# EAGLE schematic car (EAGLE 6.5.0)
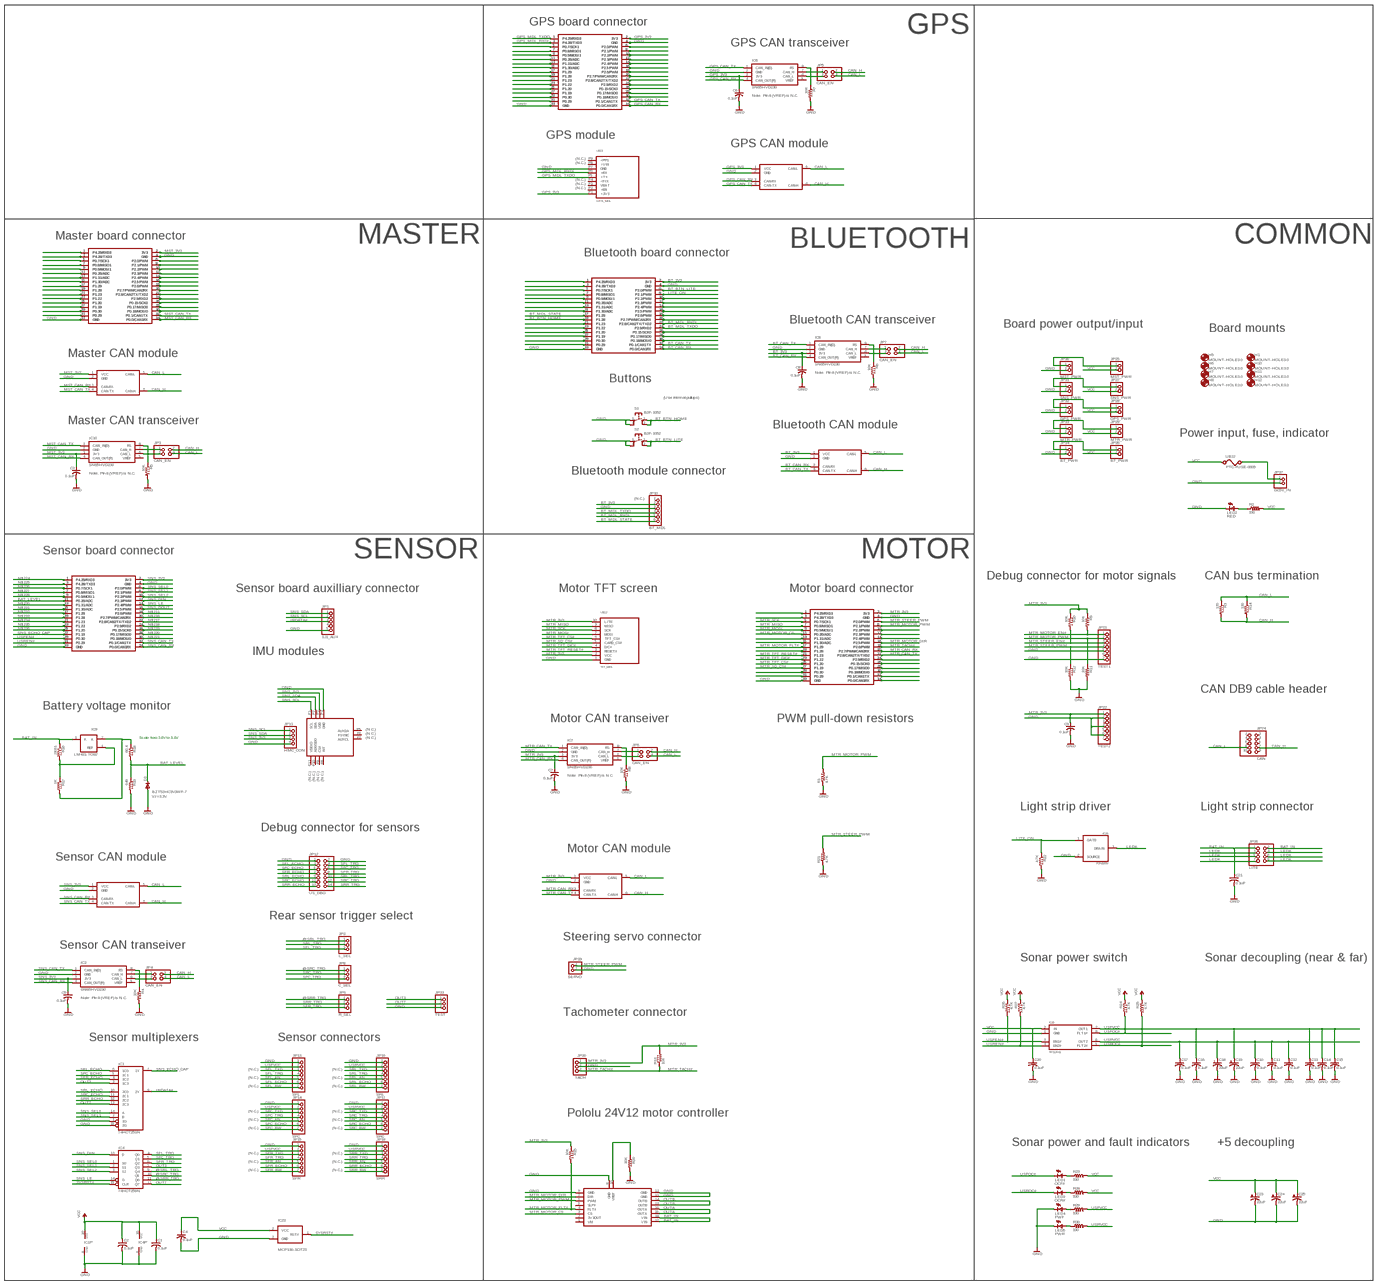
[diagram p0: schematic, sheet 1, overview]
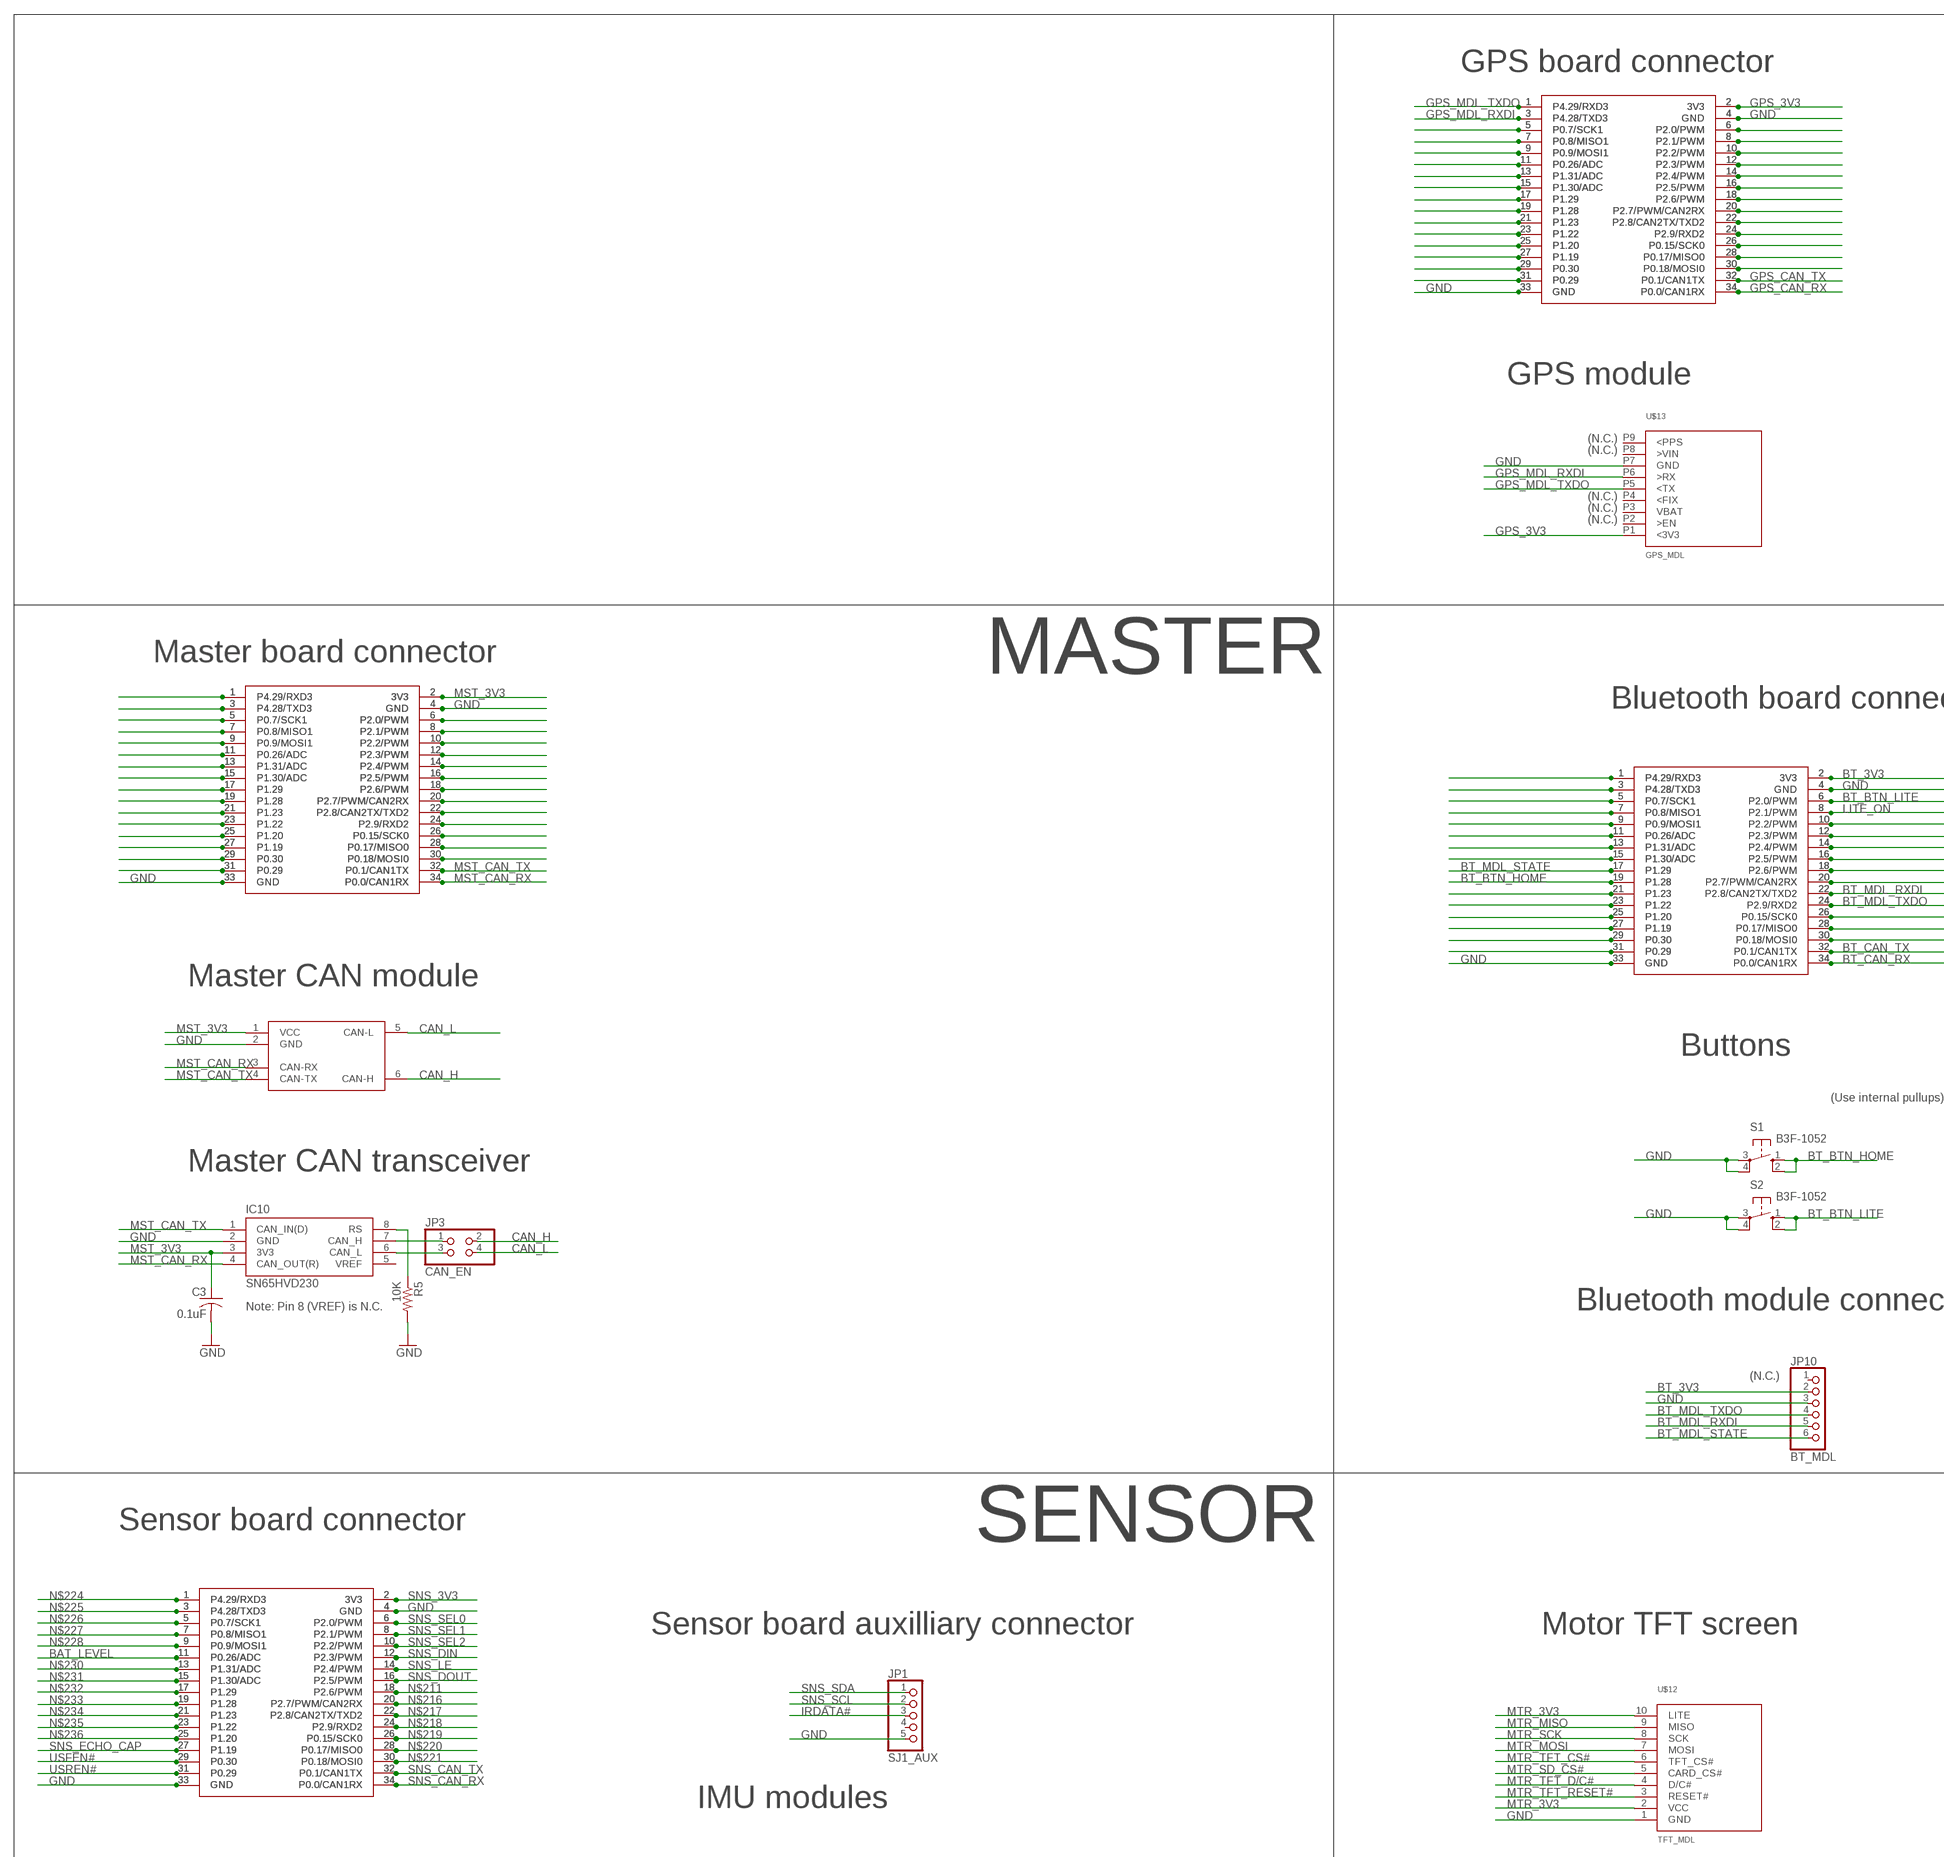
[diagram p1: schematic, sheet 1, part 1 of 4]
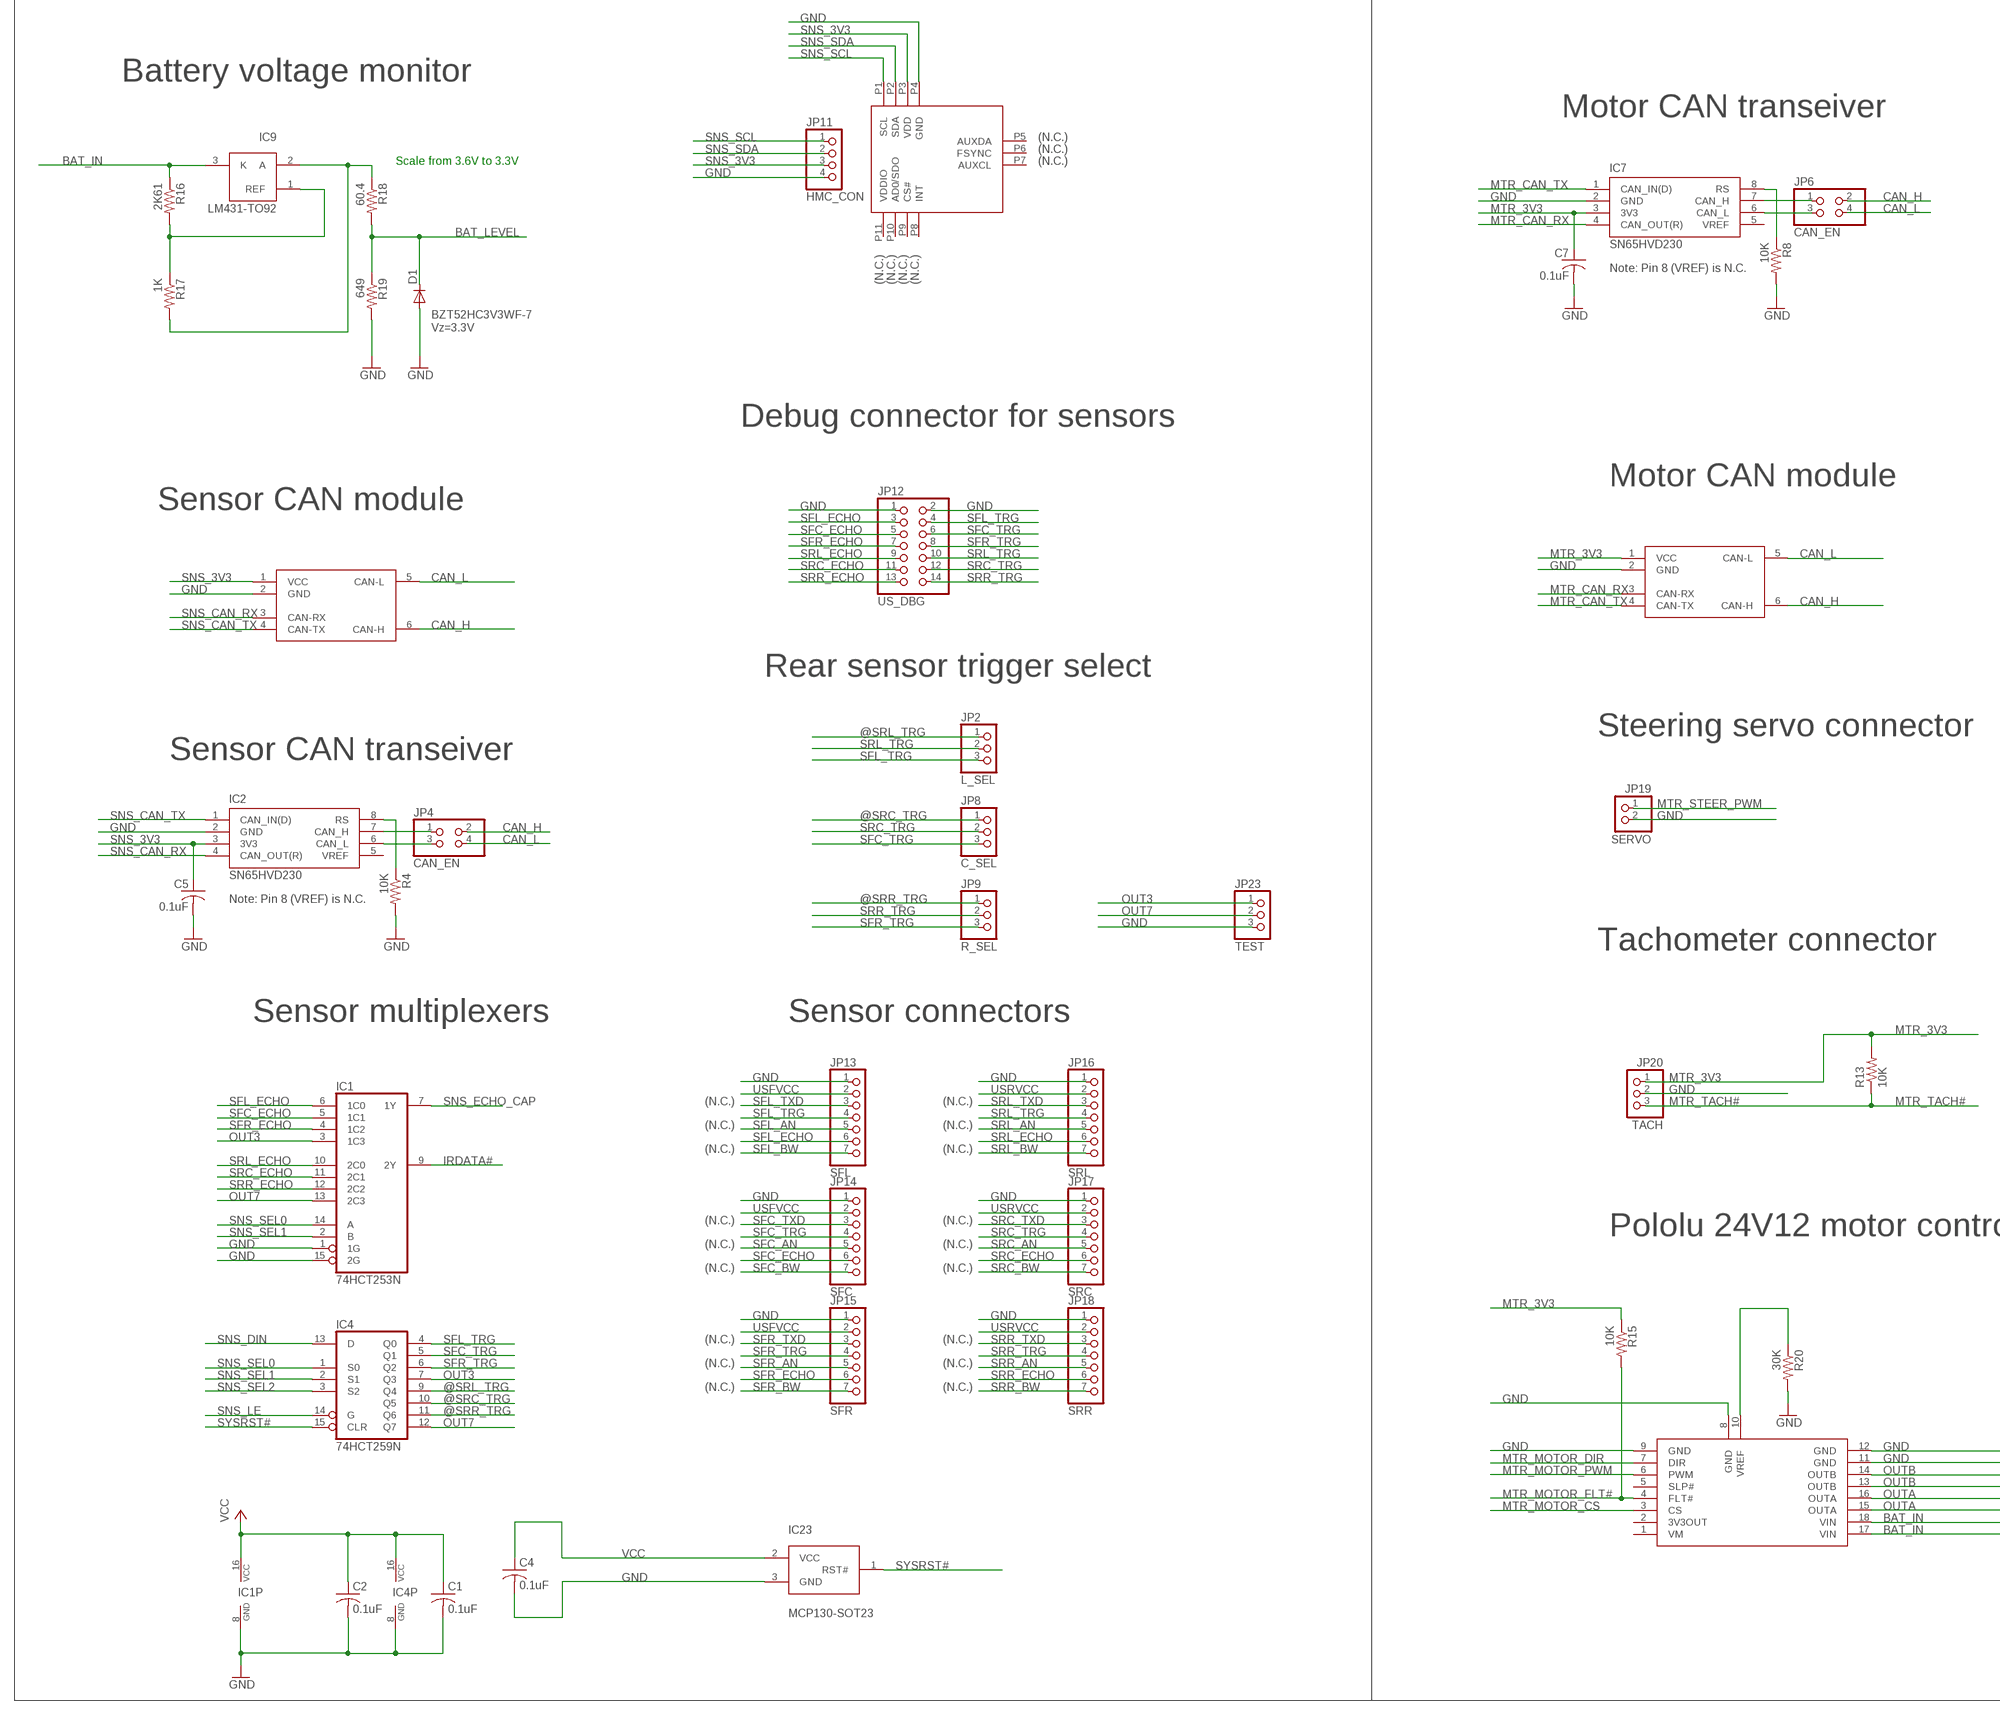
[diagram p2: schematic, sheet 1, part 2 of 4]
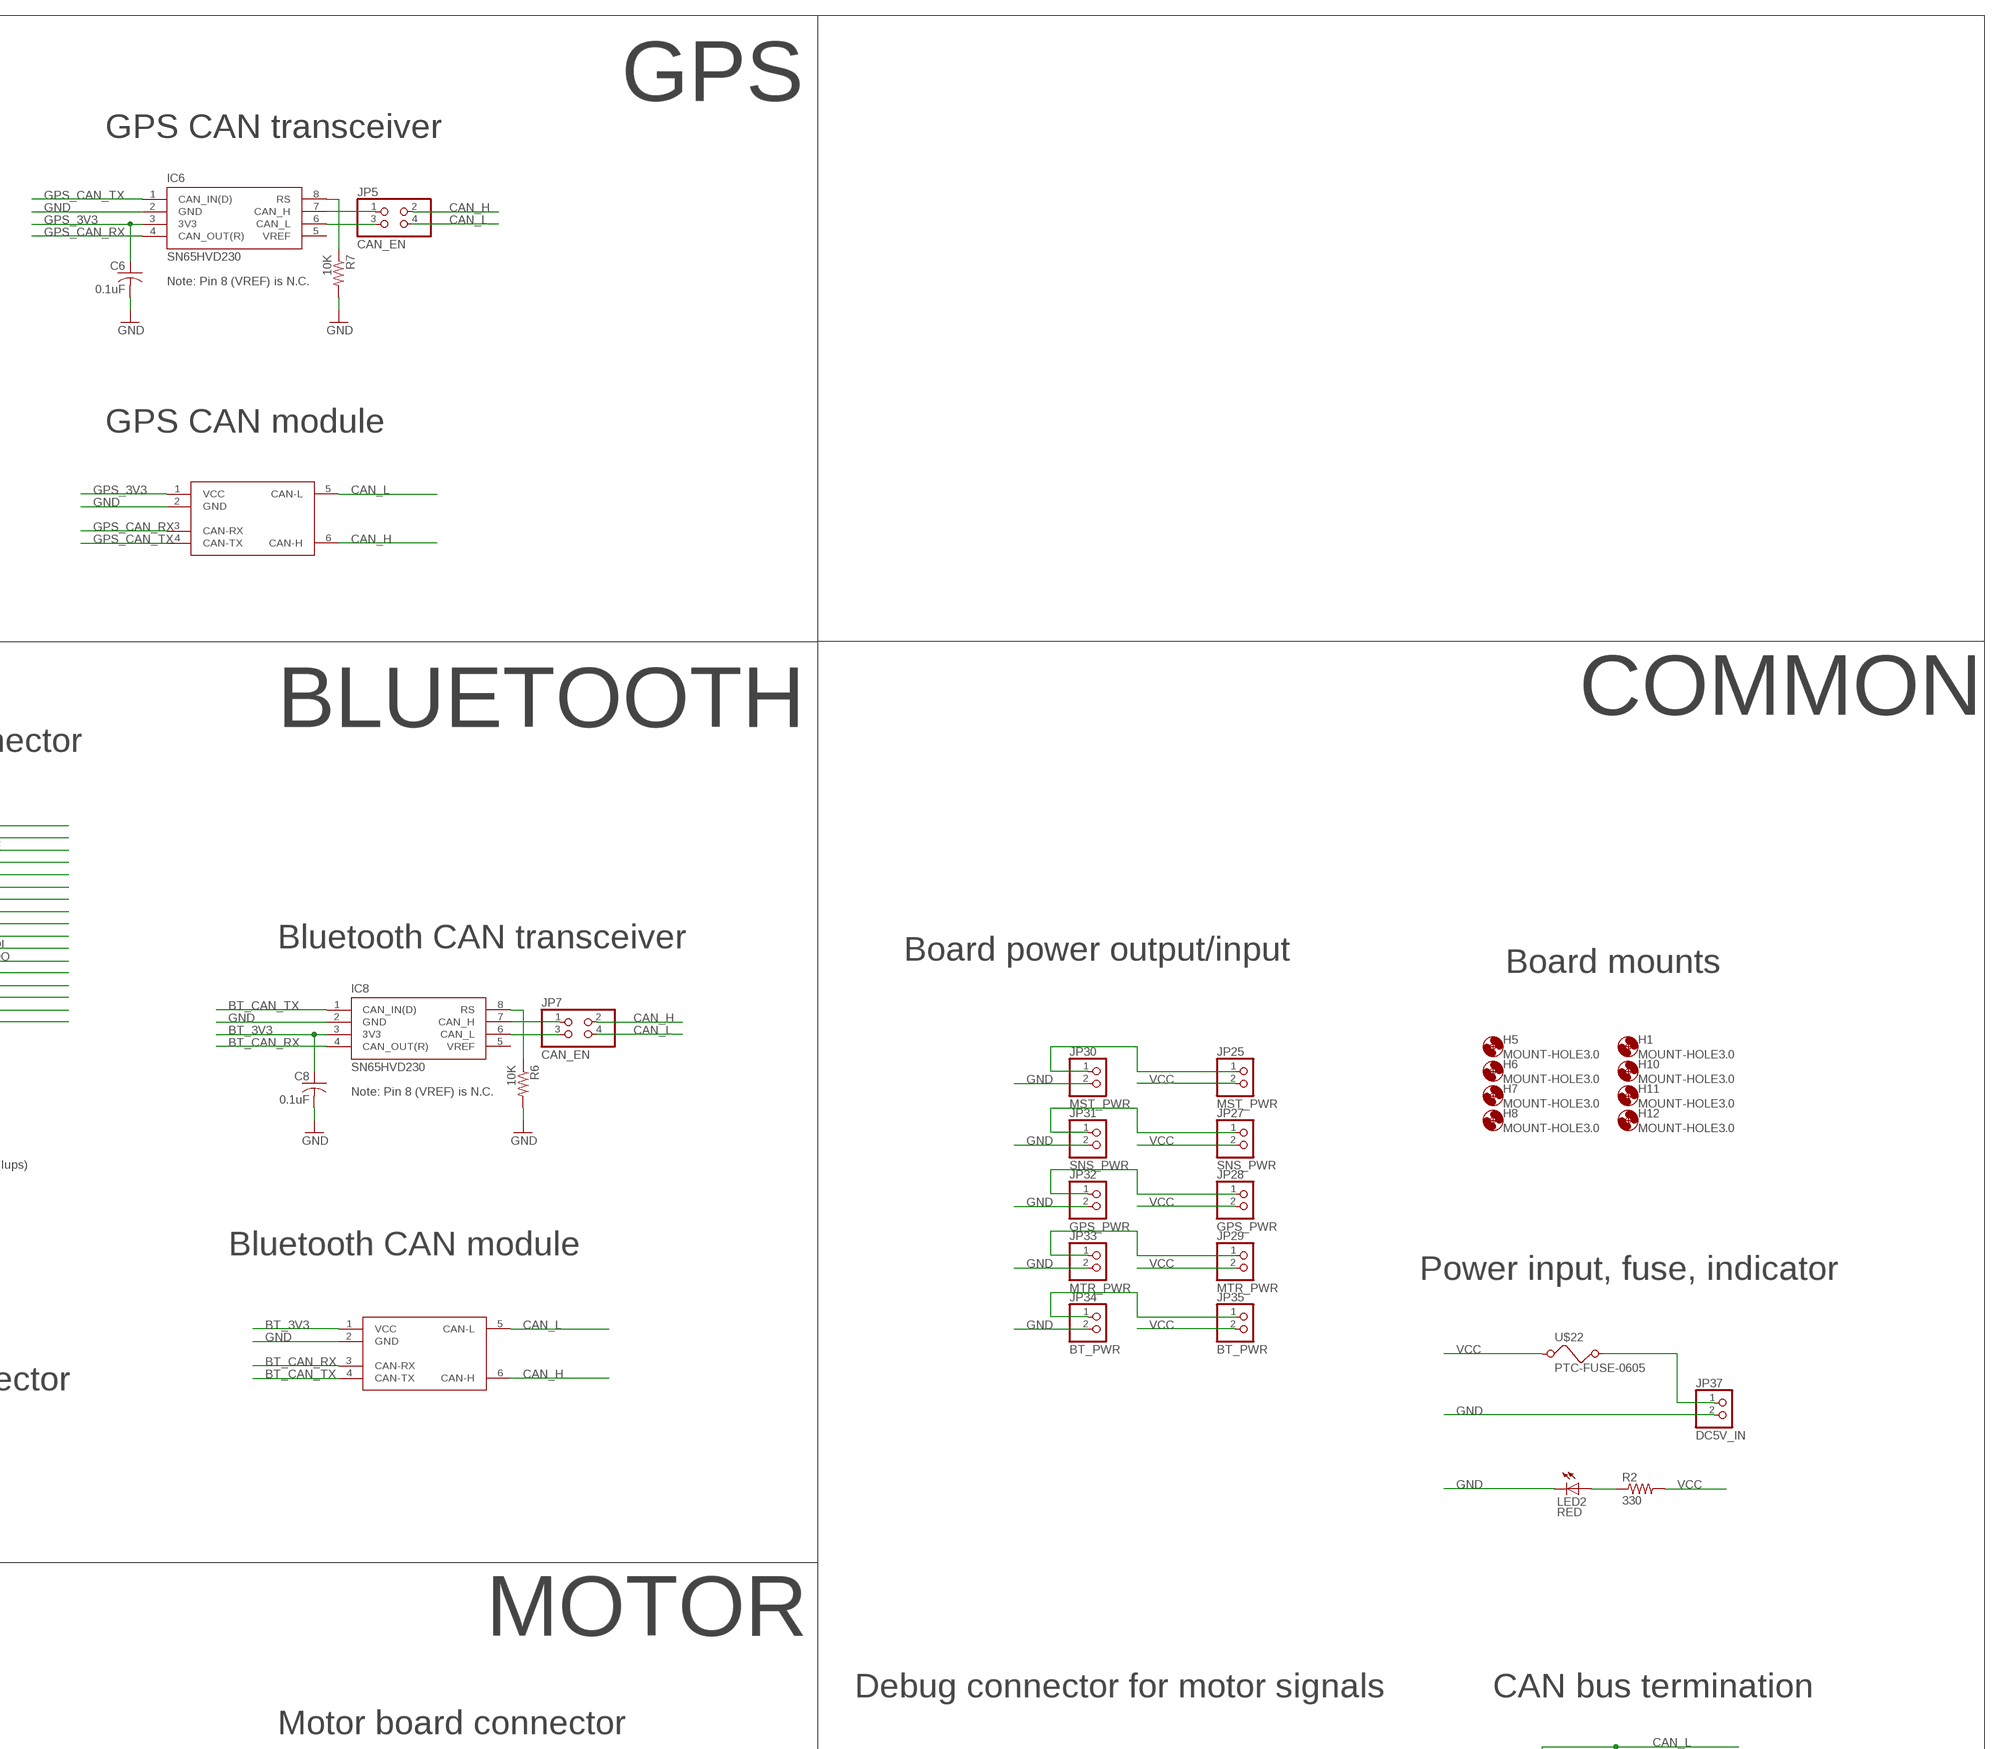
[diagram p3: schematic, sheet 1, part 3 of 4]
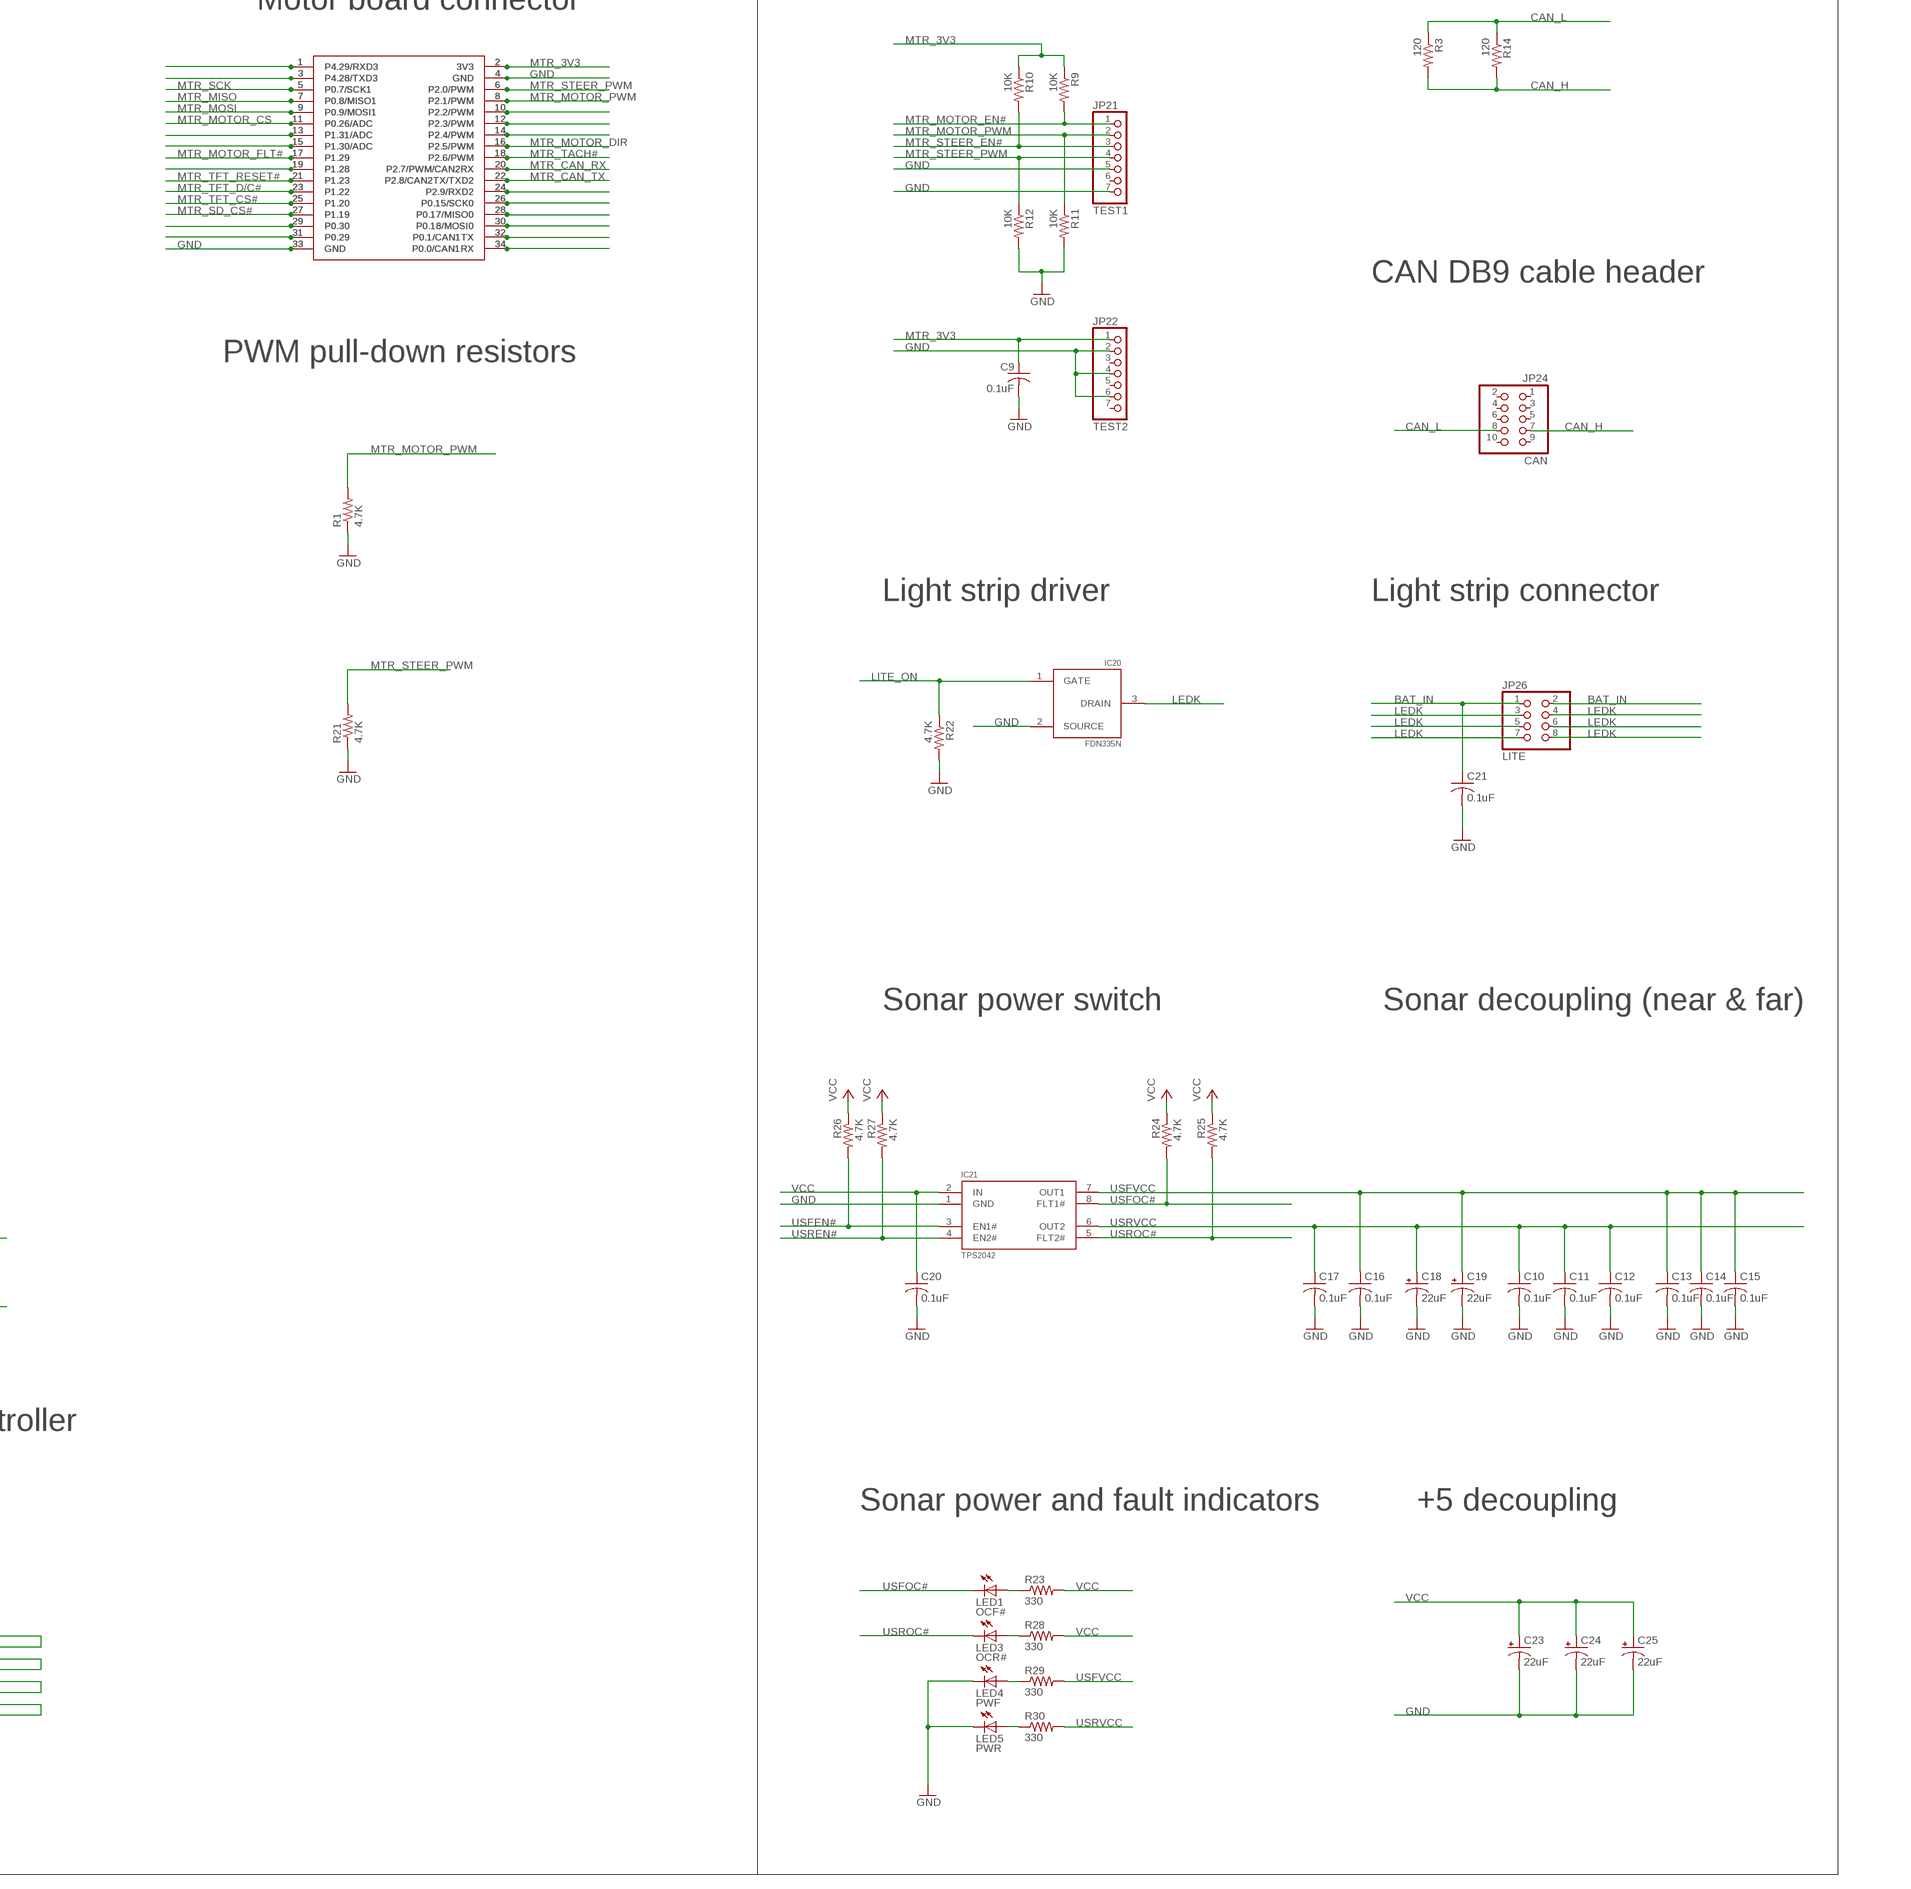
[diagram p4: schematic, sheet 1, part 4 of 4]

## Parts
C1  0.1uF  C-USC0603K  [C0603K]
C2  0.1uF  C-USC0603K  [C0603K]
C3  0.1uF  C-USC0603K  [C0603K]
C4  0.1uF  C-USC0603K  [C0603K]
C5  0.1uF  C-USC0603K  [C0603K]
C6  0.1uF  C-USC0603K  [C0603K]
C7  0.1uF  C-USC0603K  [C0603K]
C8  0.1uF  C-USC0603K  [C0603K]
C9  0.1uF  C-USC0603K  [C0603K]
C10  0.1uF  C-USC0603K  [C0603K]
C11  0.1uF  C-USC0603K  [C0603K]
C12  0.1uF  C-USC0603K  [C0603K]
C13  0.1uF  C-USC0603K  [C0603K]
C14  0.1uF  C-USC0603K  [C0603K]
C15  0.1uF  C-USC0603K  [C0603K]
C16  0.1uF  C-USC0603K  [C0603K]
C17  0.1uF  C-USC0603K  [C0603K]
C18  22uF  CPOL-USD/7343-31W  [D/7343-31W]
C19  22uF  CPOL-USD/7343-31W  [D/7343-31W]
C20  0.1uF  C-USC0603K  [C0603K]
C21  0.1uF  C-USC0603K  [C0603K]
C23  22uF  CPOL-USD/7343-31W  [D/7343-31W]
C24  22uF  CPOL-USD/7343-31W  [D/7343-31W]
C25  22uF  CPOL-USD/7343-31W  [D/7343-31W]
D1  BZT52HC3V3WF-7  DIODE-SOD323-W  [SOD323-W]
H1  MOUNT-HOLE3.0  [3,0]
H5  MOUNT-HOLE3.0  [3,0]
H6  MOUNT-HOLE3.0  [3,0]
H7  MOUNT-HOLE3.0  [3,0]
H8  MOUNT-HOLE3.0  [3,0]
H10  MOUNT-HOLE3.0  [3,0]
H11  MOUNT-HOLE3.0  [3,0]
H12  MOUNT-HOLE3.0  [3,0]
IC1  74HCT253N  [DIL16]
IC2  SN65HVD230  [SOIC8]
IC4  74HCT259N  [DIL16]
IC6  SN65HVD230  [SOIC8]
IC7  SN65HVD230  [SOIC8]
IC8  SN65HVD230  [SOIC8]
IC9  LM431-TO92  [TO-92]
IC10  SN65HVD230  [SOIC8]
IC20  FDN335N  [SOT23-3]
IC21  TPS2042  [SOIC8]
IC22  24V21  [24V21]
IC23  MCP130-SOT23  [SOT23-3]
IMU_MDL  MPU9250  [MPU9250]
JP1  SJ1_AUX  PINHD-1X5  [1X05]
JP2  L_SEL  PINHD-1X3  [1X03]
JP3  CAN_EN  PINHD-2X2  [2X02]
JP4  CAN_EN  PINHD-2X2  [2X02]
JP5  CAN_EN  PINHD-2X2  [2X02]
JP6  CAN_EN  PINHD-2X2  [2X02]
JP7  CAN_EN  PINHD-2X2  [2X02]
JP8  C_SEL  PINHD-1X3  [1X03]
JP9  R_SEL  PINHD-1X3  [1X03]
JP10  BT_MDL  PINHD-1X6  [1X06]
JP11  HMC_CON  PINHD-1X4  [1X04]
JP12  US_DBG  PINHD-2X7  [2X07]
JP13  SFL  PINHD-1X7  [1X07]
JP14  SFC  PINHD-1X7  [1X07]
JP15  SFR  PINHD-1X7  [1X07]
JP16  SRL  PINHD-1X7  [1X07]
JP17  SRC  PINHD-1X7  [1X07]
JP18  SRR  PINHD-1X7  [1X07]
JP19  SERVO  PINHD-1X2  [1X02]
JP20  TACH  PINHD-1X3  [1X03]
JP21  TEST1  PINHD-1X7  [1X07]
JP22  TEST2  PINHD-1X7  [1X07]
JP23  TEST  PINHD-1X3  [1X03]
JP24  CAN  PINHD-2X5  [2X05]
JP25  MST_PWR  PINHD-1X2  [1X02]
JP26  LITE  PINHD-2X4  [2X04]
JP27  SNS_PWR  PINHD-1X2  [1X02]
JP28  GPS_PWR  PINHD-1X2  [1X02]
JP29  MTR_PWR  PINHD-1X2  [1X02]
JP30  MST_PWR  PINHD-1X2  [1X02]
JP31  SNS_PWR  PINHD-1X2  [1X02]
JP32  GPS_PWR  PINHD-1X2  [1X02]
JP33  MTR_PWR  PINHD-1X2  [1X02]
JP34  BT_PWR  PINHD-1X2  [1X02]
JP35  BT_PWR  PINHD-1X2  [1X02]
JP37  DC5V_IN  PINHD-1X2  [1X02]
LED1  OCF#  LEDCHIPLED_0603  [CHIPLED_0603]
LED2  RED  LEDCHIPLED_0603  [CHIPLED_0603]
LED3  OCR#  LEDCHIPLED_0603  [CHIPLED_0603]
LED4  PWF  LEDCHIPLED_0603  [CHIPLED_0603]
LED5  PWR  LEDCHIPLED_0603  [CHIPLED_0603]
R1  4.7K  R-US_R0603  [R0603]
R2  330  R-US_R0603  [R0603]
R3  120  R-US_R0603  [R0603]
R4  10K  R-US_R0603  [R0603]
R5  10K  R-US_R0603  [R0603]
R6  10K  R-US_R0603  [R0603]
R7  10K  R-US_R0603  [R0603]
R8  10K  R-US_R0603  [R0603]
R9  10K  R-US_R0603  [R0603]
R10  10K  R-US_R0603  [R0603]
R11  10K  R-US_R0603  [R0603]
R12  10K  R-US_R0603  [R0603]
R13  10K  R-US_R0603  [R0603]
R14  120  R-US_R0603  [R0603]
R15  10K  R-US_R0603  [R0603]
R16  2K61  R-US_R0603  [R0603]
R17  1K  R-US_R0603  [R0603]
R18  60.4  R-US_R0603  [R0603]
R19  649  R-US_R0603  [R0603]
R20  30K  R-US_R0603  [R0603]
R21  4.7K  R-US_R0603  [R0603]
R22  4.7K  R-US_R0603  [R0603]
R23  330  R-US_R0603  [R0603]
R24  4.7K  R-US_R0603  [R0603]
R25  4.7K  R-US_R0603  [R0603]
R26  4.7K  R-US_R0603  [R0603]
R27  4.7K  R-US_R0603  [R0603]
R28  330  R-US_R0603  [R0603]
R29  330  R-US_R0603  [R0603]
R30  330  R-US_R0603  [R0603]
S1  B3F-1052  10-XX  [B3F-10XX]
S2  B3F-1052  10-XX  [B3F-10XX]
U$7  WAVESHARE-CAN  [WAVESHARE-CAN]
U$8  WAVESHARE-CAN  [WAVESHARE-CAN]
U$9  WAVESHARE-CAN  [WAVESHARE-CAN]
U$10  WAVESHARE-CAN  [WAVESHARE-CAN]
U$11  WAVESHARE-CAN  [WAVESHARE-CAN]
U$12  TFT_MDL  ADA-TFT  [ADA-TFT]
U$13  GPS_MDL  ADA-GPS  [ADA-GPS]
U$19  SJ1_CONN  [SJ1_CONN]
U$20  SJ1_CONN  [SJ1_CONN]
U$22  PTC-FUSE-0605  [R0605]
U$23  SJ1_CONN  [SJ1_CONN]
U$24  SJ1_CONN  [SJ1_CONN]
U$25  SJ1_CONN  [SJ1_CONN]
U$26  SJ1_CONN  [SJ1_CONN]
U$27  SJ1_CONN  [SJ1_CONN]
U$28  SJ1_CONN  [SJ1_CONN]
U$29  SJ1_CONN  [SJ1_CONN]
U$30  SJ1_CONN  [SJ1_CONN]

## Nets
@CAN_H: IC10.7(CAN_H) JP3.1
@CAN_H1: IC2.7(CAN_H) JP4.1
@CAN_H2: IC6.7(CAN_H) JP5.1
@CAN_H3: IC7.7(CAN_H) JP6.1
@CAN_H4: IC8.7(CAN_H) JP7.1
@CAN_L: IC10.6(CAN_L) JP3.3
@CAN_L1: IC2.6(CAN_L) JP4.3
@CAN_L2: IC6.6(CAN_L) JP5.3
@CAN_L3: IC7.6(CAN_L) JP6.3
@CAN_L4: IC8.6(CAN_L) JP7.3
@SRC_TRG: IC4.10(Q5) JP8.1
@SRL_TRG: IC4.9(Q4) JP2.1
@SRR_TRG: IC4.11(Q6) JP9.1
BAT_IN: C21.1 IC9.3(K) IC22.17(VIN) IC22.18(VIN) JP26.1 JP26.2 R16.1
BAT_LEVEL: D1.C R18.2 R19.1 U$19.11(P0.26/ADC) U$20.11(P0.26/ADC)
BT_3V3: C8.1 IC8.3(3V3) JP10.2 U$8.1(VCC) U$27.2(3V3) U$30.2(3V3)
BT_BTN_HOME: S1.1(S) S1.2(S1) U$27.19(P1.28) U$30.19(P1.28)
BT_BTN_LITE: S2.1(S) S2.2(S1) U$27.6(P2.0/PWM) U$30.6(P2.0/PWM)
BT_CAN_RX: IC8.4(CAN_OUT(R)) U$8.3(CAN-RX) U$27.34(P0.0/CAN1RX) U$30.34(P0.0/CAN1RX)
BT_CAN_TX: IC8.1(CAN_IN(D)) U$8.4(CAN-TX) U$27.32(P0.1/CAN1TX) U$30.32(P0.1/CAN1TX)
BT_MDL_RXDI: JP10.5 U$27.22(P2.8/CAN2TX/TXD2) U$30.22(P2.8/CAN2TX/TXD2)
BT_MDL_STATE: JP10.6 U$27.17(P1.29) U$30.17(P1.29)
BT_MDL_TXDO: JP10.4 U$27.24(P2.9/RXD2) U$30.24(P2.9/RXD2)
CAN_H: JP3.2 JP4.2 JP5.2 JP6.2 JP7.2 JP24.7 R3.2 R14.2 U$7.6(CAN-H) U$8.6(CAN-H) U$9.6(CAN-H) U$10.6(CAN-H) U$11.6(CAN-H)
CAN_L: JP3.4 JP4.4 JP5.4 JP6.4 JP7.4 JP24.8 R3.1 R14.1 U$7.5(CAN-L) U$8.5(CAN-L) U$9.5(CAN-L) U$10.5(CAN-L) U$11.5(CAN-L)
EXT_VCC: JP37.1 U$22.2
GND: C1.2 C2.2 C3.2 C4.2 C5.2 C6.2 C7.2 C8.2 C9.2 C10.2 C11.2 C12.2 C13.2 C14.2 C15.2 C16.2 C17.2 C18.- C19.- C20.2 C21.2 C23.- C24.- C25.- D1.A IC1.1(1G) IC1.8(GND) IC1.15(2G) IC2.2(GND) IC4.8(GND) IC6.2(GND) IC7.2(GND) IC8.2(GND) IC10.2(GND) IC20.2(SOURCE) IC21.1(GND) IC22.8(GND) IC22.9(GND) IC22.11(GND) IC22.12(GND) IC23.3(GND) IMU_MDL.P4(GND) JP1.5 JP10.3 JP11.4 JP12.1 JP12.2 JP13.1 JP14.1 JP15.1 JP16.1 JP17.1 JP18.1 JP19.2 JP20.2 JP21.5 JP21.7 JP22.2 JP22.4 JP22.6 JP23.3 JP30.2 JP31.2 JP32.2 JP33.2 JP34.2 JP37.2 LED2.C LED4.C LED5.C R1.1 R4.2 R5.2 R6.2 R7.2 R8.2 R11.2 R12.2 R19.2 R20.2 R21.1 R22.2 S1.3(P) S1.4(P1) S2.3(P) S2.4(P1) U$7.2(GND) U$8.2(GND) U$9.2(GND) U$10.2(GND) U$11.2(GND) U$12.1(GND) U$13.P7(GND) U$19.4(GND) U$19.33(GND) U$20.4(GND) U$20.33(GND) U$23.4(GND) U$23.33(GND) U$24.4(GND) U$24.33(GND) U$25.4(GND) U$25.33(GND) U$26.4(GND) U$26.33(GND) U$27.4(GND) U$27.33(GND) U$28.4(GND) U$28.33(GND) U$29.4(GND) U$29.33(GND) U$30.4(GND) U$30.33(GND)
GPS_3V3: C6.1 IC6.3(3V3) U$10.1(VCC) U$13.P1(<3V3) U$28.2(3V3) U$29.2(3V3)
GPS_CAN_RX: IC6.4(CAN_OUT(R)) U$10.3(CAN-RX) U$28.34(P0.0/CAN1RX) U$29.34(P0.0/CAN1RX)
GPS_CAN_TX: IC6.1(CAN_IN(D)) U$10.4(CAN-TX) U$28.32(P0.1/CAN1TX) U$29.32(P0.1/CAN1TX)
GPS_MDL_RXDI: U$13.P6(>RX) U$28.3(P4.28/TXD3) U$29.3(P4.28/TXD3)
GPS_MDL_TXDO: U$13.P5(<TX) U$28.1(P4.29/RXD3) U$29.1(P4.29/RXD3)
IRDATA#: IC1.9(2Y) JP1.3
LEDK: IC20.3(DRAIN) JP26.3 JP26.4 JP26.5 JP26.6 JP26.7 JP26.8
LITE_ON: IC20.1(GATE) R22.1 U$27.8(P2.1/PWM) U$30.8(P2.1/PWM)
MST_3V3: C3.1 IC10.3(3V3) U$7.1(VCC) U$23.2(3V3) U$24.2(3V3)
MST_CAN_RX: IC10.4(CAN_OUT(R)) U$7.3(CAN-RX) U$23.34(P0.0/CAN1RX) U$24.34(P0.0/CAN1RX)
MST_CAN_TX: IC10.1(CAN_IN(D)) U$7.4(CAN-TX) U$23.32(P0.1/CAN1TX) U$24.32(P0.1/CAN1TX)
MTR_3V3: C7.1 C9.1 IC7.3(3V3) JP20.1 JP22.1 R9.1 R10.1 R13.2 R15.1 U$11.1(VCC) U$12.2(VCC) U$12.10(LITE) U$25.2(3V3) U$26.2(3V3)
MTR_CAN_RX: IC7.4(CAN_OUT(R)) U$11.3(CAN-RX) U$25.20(P2.7/PWM/CAN2RX) U$26.20(P2.7/PWM/CAN2RX)
MTR_CAN_TX: IC7.1(CAN_IN(D)) U$11.4(CAN-TX) U$25.22(P2.8/CAN2TX/TXD2) U$26.22(P2.8/CAN2TX/TXD2)
MTR_MISO: U$12.9(MISO) U$25.7(P0.8/MISO1) U$26.7(P0.8/MISO1)
MTR_MOSI: U$12.7(MOSI) U$25.9(P0.9/MOSI1) U$26.9(P0.9/MOSI1)
MTR_MOTOR_CS: IC22.3(CS) U$25.11(P0.26/ADC) U$26.11(P0.26/ADC)
MTR_MOTOR_DIR: IC22.7(DIR) U$25.16(P2.5/PWM) U$26.16(P2.5/PWM)
MTR_MOTOR_EN#: JP21.1 R9.2 U$25.14(P2.4/PWM) U$26.14(P2.4/PWM)
MTR_MOTOR_FLT#: IC22.4(FLT#) R15.2 U$25.17(P1.29) U$26.17(P1.29)
MTR_MOTOR_PWM: IC22.6(PWM) JP21.2 R1.2 R11.1 U$25.8(P2.1/PWM) U$26.8(P2.1/PWM)
MTR_SCK: U$12.8(SCK) U$25.5(P0.7/SCK1) U$26.5(P0.7/SCK1)
MTR_SD_CS#: U$12.5(CARD_CS#) U$25.27(P1.19) U$26.27(P1.19)
MTR_STEER_EN#: JP21.3 R10.2 U$25.12(P2.3/PWM) U$26.12(P2.3/PWM)
MTR_STEER_PWM: JP19.1 JP21.4 R12.1 R21.2 U$25.6(P2.0/PWM) U$26.6(P2.0/PWM)
MTR_TACH#: JP20.3 R13.1 U$25.18(P2.6/PWM) U$26.18(P2.6/PWM)
MTR_TFT_CS#: U$12.6(TFT_CS#) U$25.25(P1.20) U$26.25(P1.20)
MTR_TFT_D/C#: U$12.4(D/C#) U$25.23(P1.22) U$26.23(P1.22)
MTR_TFT_RESET#: U$12.3(RESET#) U$25.21(P1.23) U$26.21(P1.23)
N$1: IC10.8(RS) R5.1
N$2: IC2.8(RS) R4.1
N$3: IC6.8(RS) R7.1
N$4: IC7.8(RS) R8.1
N$5: IC8.8(RS) R6.1
N$6: LED2.A R2.1
N$7: IC22.10(VREF) R20.1
N$8: LED1.A R23.1
N$9: LED3.A R28.1
N$10: LED4.A R29.1
N$11: LED5.A R30.1
N$12: IC9.2(A) R17.2 R18.1
N$13: JP34.1 JP35.1
N$14: U$25.1(P4.29/RXD3) U$26.1(P4.29/RXD3)
N$15: U$25.3(P4.28/TXD3) U$26.3(P4.28/TXD3)
N$16: JP29.1 JP33.1
N$17: JP28.1 JP32.1
N$18: JP27.1 JP31.1
N$19: JP25.1 JP30.1
N$23: U$25.13(P1.31/ADC) U$26.13(P1.31/ADC)
N$24: U$25.15(P1.30/ADC) U$26.15(P1.30/ADC)
N$26: U$25.19(P1.28) U$26.19(P1.28)
N$54: U$25.29(P0.30) U$26.29(P0.30)
N$55: U$25.31(P0.29) U$26.31(P0.29)
N$56: U$27.1(P4.29/RXD3) U$30.1(P4.29/RXD3)
N$57: U$27.3(P4.28/TXD3) U$30.3(P4.28/TXD3)
N$58: U$27.5(P0.7/SCK1) U$30.5(P0.7/SCK1)
N$74: U$25.10(P2.2/PWM) U$26.10(P2.2/PWM)
N$81: U$25.24(P2.9/RXD2) U$26.24(P2.9/RXD2)
N$82: U$25.26(P0.15/SCK0) U$26.26(P0.15/SCK0)
N$83: U$25.28(P0.17/MISO0) U$26.28(P0.17/MISO0)
N$84: U$25.30(P0.18/MOSI0) U$26.30(P0.18/MOSI0)
N$85: U$25.32(P0.1/CAN1TX) U$26.32(P0.1/CAN1TX)
N$86: U$25.34(P0.0/CAN1RX) U$26.34(P0.0/CAN1RX)
N$87: U$27.7(P0.8/MISO1) U$30.7(P0.8/MISO1)
N$88: U$27.9(P0.9/MOSI1) U$30.9(P0.9/MOSI1)
N$89: U$27.11(P0.26/ADC) U$30.11(P0.26/ADC)
N$90: U$27.13(P1.31/ADC) U$30.13(P1.31/ADC)
N$91: U$27.15(P1.30/ADC) U$30.15(P1.30/ADC)
N$94: U$27.21(P1.23) U$30.21(P1.23)
N$95: U$27.23(P1.22) U$30.23(P1.22)
N$96: U$27.25(P1.20) U$30.25(P1.20)
N$97: U$27.27(P1.19) U$30.27(P1.19)
N$98: U$27.29(P0.30) U$30.29(P0.30)
N$99: U$27.31(P0.29) U$30.31(P0.29)
N$105: U$27.10(P2.2/PWM) U$30.10(P2.2/PWM)
N$106: U$27.12(P2.3/PWM) U$30.12(P2.3/PWM)
N$121: U$27.14(P2.4/PWM) U$30.14(P2.4/PWM)
N$122: U$27.16(P2.5/PWM) U$30.16(P2.5/PWM)
N$124: U$27.18(P2.6/PWM) U$30.18(P2.6/PWM)
N$125: U$27.20(P2.7/PWM/CAN2RX) U$30.20(P2.7/PWM/CAN2RX)
N$191: IC9.1(REF) R16.2 R17.1
N$192: U$23.1(P4.29/RXD3) U$24.1(P4.29/RXD3)
N$193: U$23.3(P4.28/TXD3) U$24.3(P4.28/TXD3)
N$209: U$23.5(P0.7/SCK1) U$24.5(P0.7/SCK1)
N$210: U$23.7(P0.8/MISO1) U$24.7(P0.8/MISO1)
N$211: U$19.18(P2.6/PWM) U$20.18(P2.6/PWM)
N$216: U$19.20(P2.7/PWM/CAN2RX) U$20.20(P2.7/PWM/CAN2RX)
N$217: U$19.22(P2.8/CAN2TX/TXD2) U$20.22(P2.8/CAN2TX/TXD2)
N$218: U$19.24(P2.9/RXD2) U$20.24(P2.9/RXD2)
N$219: U$19.26(P0.15/SCK0) U$20.26(P0.15/SCK0)
N$220: U$19.28(P0.17/MISO0) U$20.28(P0.17/MISO0)
N$221: U$19.30(P0.18/MOSI0) U$20.30(P0.18/MOSI0)
N$224: U$19.1(P4.29/RXD3) U$20.1(P4.29/RXD3)
N$225: U$19.3(P4.28/TXD3) U$20.3(P4.28/TXD3)
N$226: U$19.5(P0.7/SCK1) U$20.5(P0.7/SCK1)
N$227: U$19.7(P0.8/MISO1) U$20.7(P0.8/MISO1)
N$228: U$19.9(P0.9/MOSI1) U$20.9(P0.9/MOSI1)
N$230: U$19.13(P1.31/ADC) U$20.13(P1.31/ADC)
N$231: U$19.15(P1.30/ADC) U$20.15(P1.30/ADC)
N$232: U$19.17(P1.29) U$20.17(P1.29)
N$233: U$19.19(P1.28) U$20.19(P1.28)
N$234: U$19.21(P1.23) U$20.21(P1.23)
N$235: U$19.23(P1.22) U$20.23(P1.22)
N$236: U$19.25(P1.20) U$20.25(P1.20)
N$237: U$23.9(P0.9/MOSI1) U$24.9(P0.9/MOSI1)
N$240: U$23.11(P0.26/ADC) U$24.11(P0.26/ADC)
N$247: U$23.13(P1.31/ADC) U$24.13(P1.31/ADC)
N$248: U$23.15(P1.30/ADC) U$24.15(P1.30/ADC)
N$249: U$23.17(P1.29) U$24.17(P1.29)
N$250: U$23.19(P1.28) U$24.19(P1.28)
N$251: U$23.21(P1.23) U$24.21(P1.23)
N$252: U$23.23(P1.22) U$24.23(P1.22)
N$253: U$23.25(P1.20) U$24.25(P1.20)
N$254: U$23.27(P1.19) U$24.27(P1.19)
N$255: U$23.29(P0.30) U$24.29(P0.30)
N$256: U$23.31(P0.29) U$24.31(P0.29)
N$257: U$27.26(P0.15/SCK0) U$30.26(P0.15/SCK0)
N$258: U$27.28(P0.17/MISO0) U$30.28(P0.17/MISO0)
N$259: U$27.30(P0.18/MOSI0) U$30.30(P0.18/MOSI0)
N$260: U$23.6(P2.0/PWM) U$24.6(P2.0/PWM)
N$261: U$23.8(P2.1/PWM) U$24.8(P2.1/PWM)
N$262: U$23.10(P2.2/PWM) U$24.10(P2.2/PWM)
N$263: U$23.12(P2.3/PWM) U$24.12(P2.3/PWM)
N$264: U$23.14(P2.4/PWM) U$24.14(P2.4/PWM)
N$265: U$23.16(P2.5/PWM) U$24.16(P2.5/PWM)
N$266: U$23.18(P2.6/PWM) U$24.18(P2.6/PWM)
N$267: U$23.20(P2.7/PWM/CAN2RX) U$24.20(P2.7/PWM/CAN2RX)
N$268: U$23.22(P2.8/CAN2TX/TXD2) U$24.22(P2.8/CAN2TX/TXD2)
N$269: U$23.24(P2.9/RXD2) U$24.24(P2.9/RXD2)
N$270: U$23.26(P0.15/SCK0) U$24.26(P0.15/SCK0)
N$271: U$23.28(P0.17/MISO0) U$24.28(P0.17/MISO0)
N$272: U$23.30(P0.18/MOSI0) U$24.30(P0.18/MOSI0)
N$279: U$28.5(P0.7/SCK1) U$29.5(P0.7/SCK1)
N$280: U$28.7(P0.8/MISO1) U$29.7(P0.8/MISO1)
N$281: U$28.9(P0.9/MOSI1) U$29.9(P0.9/MOSI1)
N$282: U$28.11(P0.26/ADC) U$29.11(P0.26/ADC)
N$283: U$28.13(P1.31/ADC) U$29.13(P1.31/ADC)
N$284: U$28.15(P1.30/ADC) U$29.15(P1.30/ADC)
N$285: U$28.17(P1.29) U$29.17(P1.29)
N$286: U$28.19(P1.28) U$29.19(P1.28)
N$287: U$28.21(P1.23) U$29.21(P1.23)
N$288: U$28.23(P1.22) U$29.23(P1.22)
N$289: U$28.25(P1.20) U$29.25(P1.20)
N$290: U$28.27(P1.19) U$29.27(P1.19)
N$291: U$28.29(P0.30) U$29.29(P0.30)
N$292: U$28.31(P0.29) U$29.31(P0.29)
N$296: U$28.6(P2.0/PWM) U$29.6(P2.0/PWM)
N$297: U$28.8(P2.1/PWM) U$29.8(P2.1/PWM)
N$298: U$28.10(P2.2/PWM) U$29.10(P2.2/PWM)
N$299: U$28.12(P2.3/PWM) U$29.12(P2.3/PWM)
N$300: U$28.14(P2.4/PWM) U$29.14(P2.4/PWM)
N$301: U$28.16(P2.5/PWM) U$29.16(P2.5/PWM)
N$302: U$28.18(P2.6/PWM) U$29.18(P2.6/PWM)
N$303: U$28.20(P2.7/PWM/CAN2RX) U$29.20(P2.7/PWM/CAN2RX)
N$304: U$28.22(P2.8/CAN2TX/TXD2) U$29.22(P2.8/CAN2TX/TXD2)
N$305: U$28.24(P2.9/RXD2) U$29.24(P2.9/RXD2)
N$306: U$28.26(P0.15/SCK0) U$29.26(P0.15/SCK0)
N$307: U$28.28(P0.17/MISO0) U$29.28(P0.17/MISO0)
N$308: U$28.30(P0.18/MOSI0) U$29.30(P0.18/MOSI0)
OUT3: IC1.3(1C3) IC4.7(Q3) JP23.1
OUT7: IC1.13(2C3) IC4.12(Q7) JP23.2
OUTA: IC22.15(OUTA) IC22.16(OUTA)
OUTB: IC22.13(OUTB) IC22.14(OUTB)
SFC_AN: JP14.5
SFC_BW: JP14.7
SFC_ECHO: IC1.5(1C1) JP12.5 JP14.6
SFC_TRG: IC4.5(Q1) JP8.3 JP12.6 JP14.4
SFC_TXD: JP14.3
SFL_AN: JP13.5
SFL_BW: JP13.7
SFL_ECHO: IC1.6(1C0) JP12.3 JP13.6
SFL_TRG: IC4.4(Q0) JP2.3 JP12.4 JP13.4
SFL_TXD: JP13.3
SFR_AN: JP15.5
SFR_BW: JP15.7
SFR_ECHO: IC1.4(1C2) JP12.7 JP15.6
SFR_TRG: IC4.6(Q2) JP9.3 JP12.8 JP15.4
SFR_TXD: JP15.3
SNS_3V3: C5.1 IC2.3(3V3) IMU_MDL.P3(VDD) JP11.3 U$9.1(VCC) U$19.2(3V3) U$20.2(3V3)
SNS_CAN_RX: IC2.4(CAN_OUT(R)) U$9.3(CAN-RX) U$19.34(P0.0/CAN1RX) U$20.34(P0.0/CAN1RX)
SNS_CAN_TX: IC2.1(CAN_IN(D)) U$9.4(CAN-TX) U$19.32(P0.1/CAN1TX) U$20.32(P0.1/CAN1TX)
SNS_DIN: IC4.13(D) U$19.12(P2.3/PWM) U$20.12(P2.3/PWM)
SNS_DOUT: U$19.16(P2.5/PWM) U$20.16(P2.5/PWM)
SNS_ECHO_CAP: IC1.7(1Y) U$19.27(P1.19) U$20.27(P1.19)
SNS_LE: IC4.14(G) U$19.14(P2.4/PWM) U$20.14(P2.4/PWM)
SNS_SCL: IMU_MDL.P1(SCL) JP1.2 JP11.1
SNS_SDA: IMU_MDL.P2(SDA) JP1.1 JP11.2
SNS_SEL0: IC1.14(A) IC4.1(S0) U$19.6(P2.0/PWM) U$20.6(P2.0/PWM)
SNS_SEL1: IC1.2(B) IC4.2(S1) U$19.8(P2.1/PWM) U$20.8(P2.1/PWM)
SNS_SEL2: IC4.3(S2) U$19.10(P2.2/PWM) U$20.10(P2.2/PWM)
SRC_AN: JP17.5
SRC_BW: JP17.7
SRC_ECHO: IC1.11(2C1) JP12.11 JP17.6
SRC_TRG: JP8.2 JP12.12 JP17.4
SRC_TXD: JP17.3
SRL_AN: JP16.5
SRL_BW: JP16.7
SRL_ECHO: IC1.10(2C0) JP12.9 JP16.6
SRL_TRG: JP2.2 JP12.10 JP16.4
SRL_TXD: JP16.3
SRR_AN: JP18.5
SRR_BW: JP18.7
SRR_ECHO: IC1.12(2C2) JP12.13 JP18.6
SRR_TRG: JP9.2 JP12.14 JP18.4
SRR_TXD: JP18.3
SYSRST#: IC4.15(CLR) IC23.1(RST#)
USFEN#: IC21.3(EN1#) R26.2 U$19.29(P0.30) U$20.29(P0.30)
USFOC#: IC21.8(FLT1#) LED1.C R24.2
USFVCC: C13.1 C14.1 C15.1 C16.1 C19.+ IC21.7(OUT1) JP13.2 JP14.2 JP15.2 R29.2
USREN#: IC21.4(EN2#) R27.2 U$19.31(P0.29) U$20.31(P0.29)
USROC#: IC21.5(FLT2#) LED3.C R25.2
USRVCC: C10.1 C11.1 C12.1 C17.1 C18.+ IC21.6(OUT2) JP16.2 JP17.2 JP18.2 R30.2
VCC: C1.1 C2.1 C4.1 C20.1 C23.+ C24.+ C25.+ IC1.16(VCC) IC4.16(VCC) IC21.2(IN) IC23.2(VCC) JP25.2 JP27.2 JP28.2 JP29.2 JP35.2 R2.2 R23.2 R24.1 R25.1 R26.1 R27.1 R28.2 U$22.1
Unconnected: IC2.5(VREF) IC6.5(VREF) IC7.5(VREF) IC8.5(VREF) IC10.5(VREF) IC22.1(VM) IC22.2(3V3OUT) IC22.5(SLP#) IMU_MDL.P5(AUXDA) IMU_MDL.P6(FSYNC) IMU_MDL.P7(AUXCL) IMU_MDL.P8(INT) IMU_MDL.P9(CS#) IMU_MDL.P10(AD0/SDO) IMU_MDL.P11(VDDIO) JP1.4 JP10.1 JP21.6 JP22.3 JP22.5 JP22.7 JP24.1 JP24.2 JP24.3 JP24.4 JP24.5 JP24.6 JP24.9 JP24.10 U$13.P2(>EN) U$13.P3(VBAT) U$13.P4(<FIX) U$13.P8(>VIN) U$13.P9(<PPS)

## Notes on the sheet
- GPS board connector
- GPS
- GPS CAN transceiver
- Note: Pin 8 (VREF) is N.C.
- GPS module
- GPS CAN module
- (N.C.)
- (N.C.)
- (N.C.)
- (N.C.)
- (N.C.)
- Master board connector
- MASTER | BLUETOOTH | COMMON
- Bluetooth board connector
- Bluetooth CAN transceiver
- Board power output/input
- Board mounts
- Master CAN module
- Note: Pin 8 (VREF) is N.C.
- Buttons
- (Use internal pullups)
- Master CAN transceiver
- Bluetooth CAN module
- Power input, fuse, indicator
- Note: Pin 8 (VREF) is N.C. | Bluetooth module connector
- (N.C.)
- Sensor board connector
- SENSOR | MOTOR
- Debug connector for motor signals | CAN bus termination
- Sensor board auxilliary connector | Motor TFT screen | Motor board connector
- IMU modules
- CAN DB9 cable header
- Battery voltage monitor
- Motor CAN transeiver | PWM pull-down resistors
- (N.C.)
- (N.C.)
- Scale from 3.6V to 3.3V | (N.C.)
- Note: Pin 8 (VREF) is N.C.
- (N.C.) | (N.C.) | (N.C.) | (N.C.)
- Vz=3.3V
- Light strip driver | Light strip connector
- Debug connector for sensors
- Motor CAN module
- Sensor CAN module
- Rear sensor trigger select
- Steering servo connector
- Sensor CAN transeiver
- Sonar power switch | Sonar decoupling (near & far)
- Note: Pin 8 (VREF) is N.C.
- Tachometer connector
- Sensor multiplexers | Sensor connectors
- (N.C.) | (N.C.)
- (N.C.) | (N.C.)
- (N.C.) | (N.C.)
- (N.C.) | (N.C.)
- Pololu 24V12 motor controller
- (N.C.) | (N.C.)
- (N.C.) | (N.C.)
- Sonar power and fault indicators | +5 decoupling
- (N.C.) | (N.C.)
- (N.C.) | (N.C.)
- (N.C.) | (N.C.)

## Library data of the parts
C1-C17 C20 C21 = rcl:C-US: CAPACITOR, American symbol
C18 C19 C23-C25 = resistor:CPOL-US: POLARIZED CAPACITOR, American symbol
D1 = diode:DIODE-: DIODE
H1 H5-H8 H10-H12 = holes:MOUNT-HOLE: MOUNTING HOLE with drill center marker
IC1 = 74xx-eu:74*253: Dual 4-to 1 line data SELECTOR/MULTIPLEXER, 3-state
IC2 IC6-IC8 IC10 = charles-lib:SN65HVD230
IC4 = 74xx-eu:74*259: 8-bit addressable LATCH
IC9 = charles-lib:LM431-TO92
IC20 = charles-lib:FDN335N
IC21 = charles-lib:TPS2042
IC22 = charles-lib:24V21
IC23 = charles-lib:MCP130-SOT23
IMU_MDL = charles-lib:MPU9250
JP1 = pinhead:PINHD-1X5: PIN HEADER
JP2 JP8 JP9 JP20 JP23 = pinhead:PINHD-1X3: PIN HEADER
JP3-JP7 = pinhead:PINHD-2X2: PIN HEADER
JP10 = pinhead:PINHD-1X6: PIN HEADER
JP11 = pinhead:PINHD-1X4: PIN HEADER
JP12 = pinhead:PINHD-2X7: PIN HEADER
JP13-JP18 JP21 JP22 = pinhead:PINHD-1X7: PIN HEADER
JP19 JP25 JP27-JP35 JP37 = pinhead:PINHD-1X2: PIN HEADER
JP24 = pinhead:PINHD-2X5: PIN HEADER
JP26 = pinhead:PINHD-2X4: PIN HEADER
LED1-LED5 = led:LED: LED OSRAM: - CHIPLED LG R971, LG N971, LY N971, LG Q971, LY Q971, LO R971, LY R971 LH N974, LH R974 LS Q976, LO Q976, LY Q976 LO Q996 - Hyper CHIPLED LW Q18S LB Q993, LB Q99A, LB R99A - SideLED LS A670, LO A670, LY A670, LG A670, LP A670 LB A673, LV A673, LT A673, LW A673 LH A674 LY A675 LS A676, LA A676, LO A676, LY A676, LW A676 LS A679, LY A679, LG A679 - Hyper Micro SIDELED® LS Y876, LA Y876, LO Y876, LY Y876 LT Y87S - SmartLED LW L88C, LW L88S LB L89C, LB L89S, LG L890 LS L89K, LO L89K, LY L89K LS L896, LA L896, LO L896, LY L896 - TOPLED LS T670, LO T670, LY T670, LG T670, LP T670 LSG T670, LSP T670, LSY T670, LOP T670, LYG T670 LG T671, LOG T671, LSG T671 LB T673, LV T673, LT T673, LW T673 LH T674 LS T676, LA T676, LO T676, LY T676, LB T676, LH T676, LSB T676, LW T676 LB T67C, LV T67C, LT T67C, LS T67K, LO T67K, LY T67K, LW E67C LS E67B, LA E67B, LO E67B, LY E67B, LB E67C, LV E67C, LT E67C LW T67C LS T679, LY T679, LG T679 LS T770, LO T770, LY T770, LG T770, LP T770 LB T773, LV T773, LT T773, LW T773 LH T774 LS E675, LA E675, LY E675, LS T675 LS T776, LA T776, LO T776, LY T776, LB T776 LHGB T686 LT T68C, LB T68C - Hyper Mini TOPLED® LB M676 - Mini TOPLED Santana® LG M470 LS M47K, LO M47K, LY M47K Source: http://www.osram.convergy.de LUXEON: - LUMILED® LXK2-PW12-R00, LXK2-PW12-S00, LXK2-PW14-U00, LXK2-PW14-V00 LXK2-PM12-R00, LXK2-PM12-S00, LXK2-PM14-U00 LXK2-PE12-Q00, LXK2-PE12-R00, LXK2-PE12-S00, LXK2-PE14-T00, LXK2-PE14-U00 LXK2-PB12-K00, LXK2-PB12-L00, LXK2-PB12-M00, LXK2-PB14-N00, LXK2-PB14-P00, LXK2-PB14-Q00 LXK2-PR12-L00, LXK2-PR12-M00, LXK2-PR14-Q00, LXK2-PR14-R00 LXK2-PD12-Q00, LXK2-PD12-R00, LXK2-PD12-S00 LXK2-PH12-R00, LXK2-PH12-S00 LXK2-PL12-P00, LXK2-PL12-Q00, LXK2-PL12-R00 Source: www.luxeon.com KINGBRIGHT: KA-3528ASYC Source: www.kingbright.com
R1-R30 = rcl:R-US_: RESISTOR, American symbol
S1 S2 = switch-omron:10-XX: OMRON SWITCH; MPN: B3F-1000; OC_FARNELL: 176432; OC_NEWARK: 36M3542
U$7-U$11 = charles-lib:WAVESHARE-CAN
U$12 = charles-lib:ADA-TFT
U$13 = charles-lib:ADA-GPS
U$19 U$20 U$23-U$30 = charles-lib:SJ1_CONN
U$22 = charles-lib:PTC-FUSE-0605